# EAGLE schematic EnvironmentOnAStickV2 (EAGLE 7.4.0)
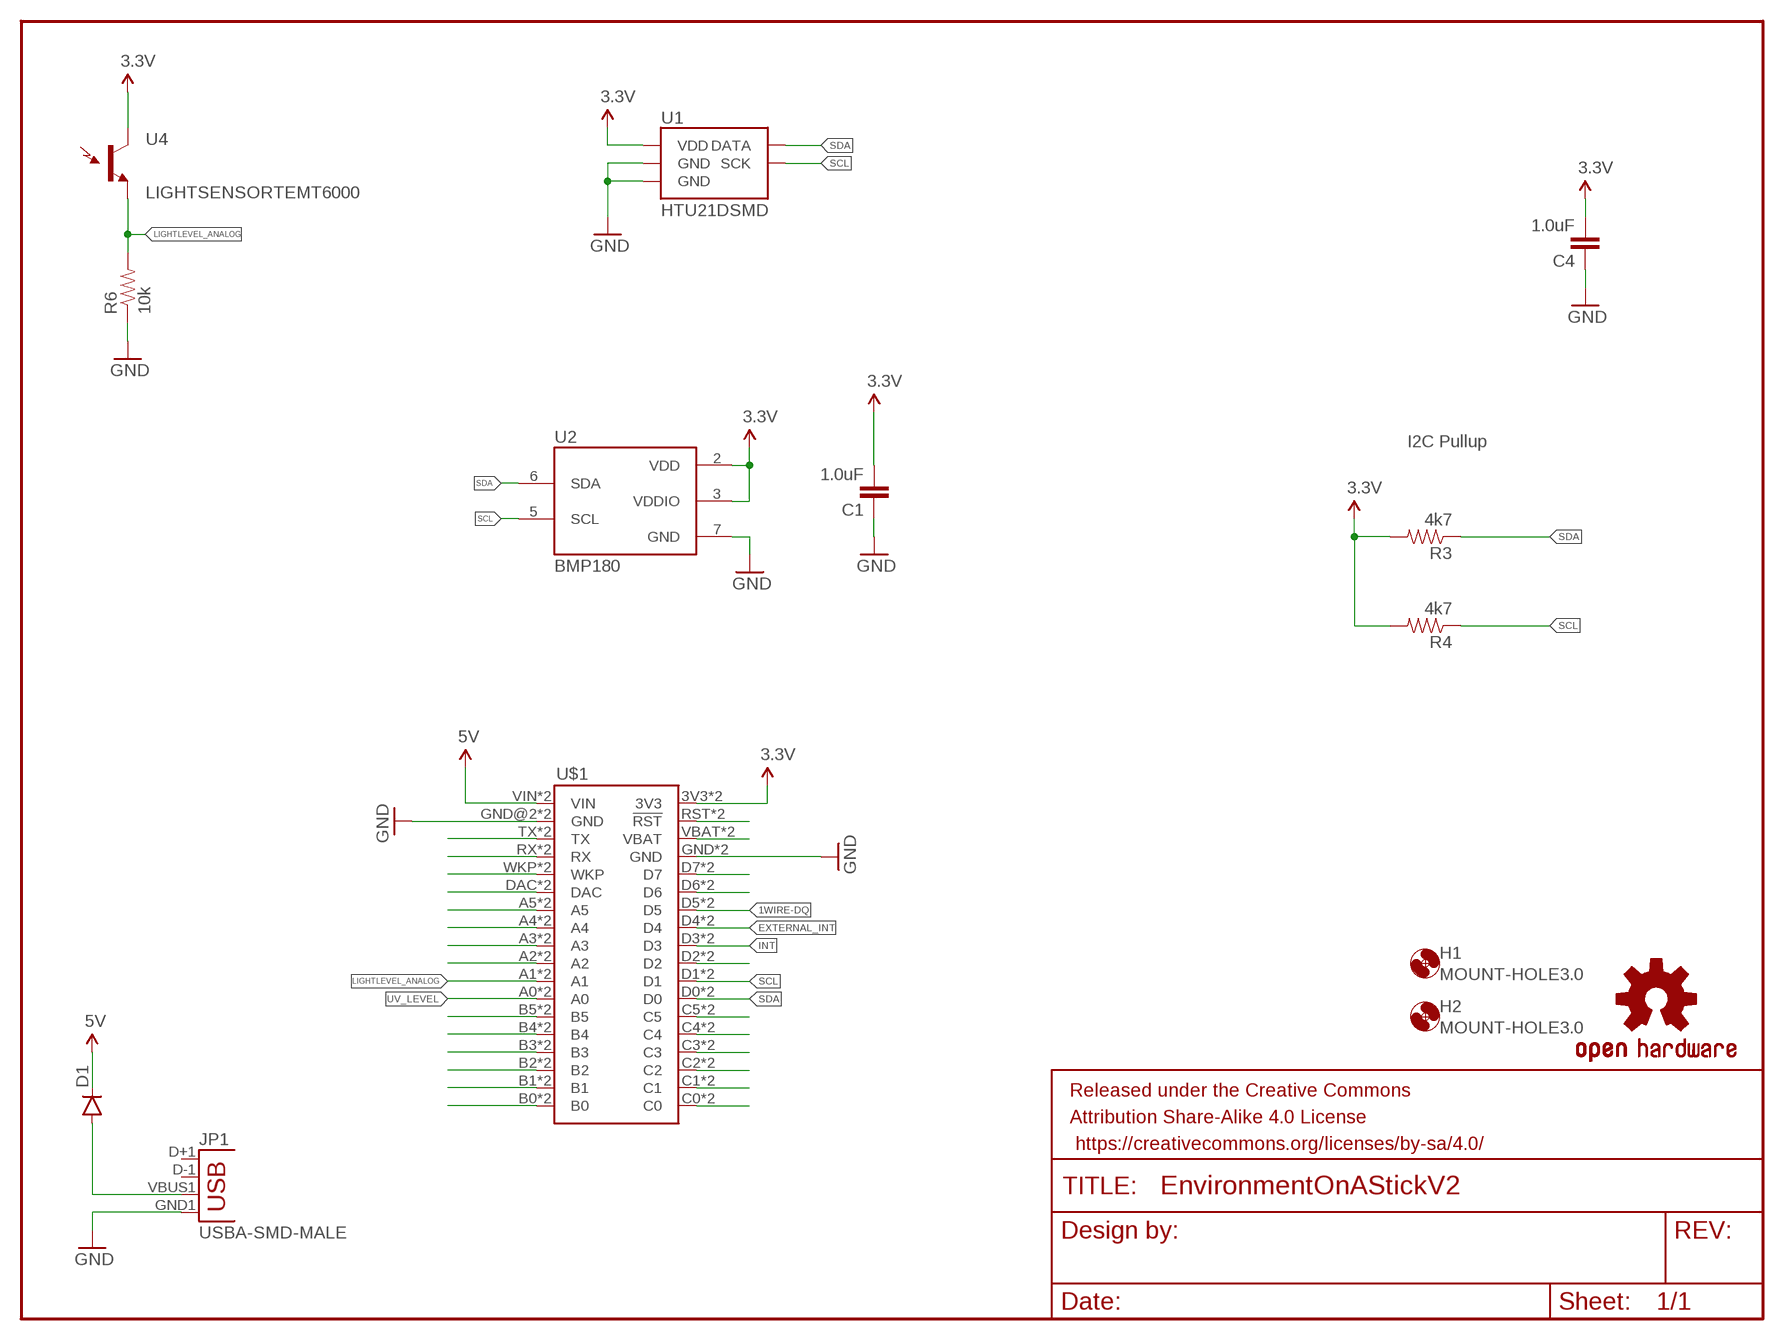
[diagram p0: schematic, sheet 1]

## Parts
C1  1.0uF  1.0UF-25V-+80/-20(0805)"  [0805-CAP]
C4  1.0uF  1.0UF-25V-+80/-20(0805)"  [0805-CAP]
D1  DIODESMA  [SMA-DIODE]
FRAME1  FRAME-LETTER  [CREATIVE_COMMONS]
H1  MOUNT-HOLE3.0  [3,0]
H2  MOUNT-HOLE3.0  [3,0]
JP1  USBA-SMD-MALE  [USB-A-SMT-MALE]
LOGO1  OSHW-LOGOM  [OSHW-LOGO-M]
R3  4k7  RESISTOR0805-RES  [0805]
R4  4k7  RESISTOR0805-RES  [0805]
R6  10k  RESISTOR0805-RES  [0805]
U1  HTU21DSMD  [HTU21D]
U2  BMP180  [BMP180]
U4  LIGHTSENSORTEMT6000  [TEMT6000-SEN]
U$1  ELECTRONDUALNAMED  [ELECTRON_SIMPLE_SILK_NAMES_DUAL]

## Nets
1WIRE-DQ: U$1.D5 U$1.D5_1(D5)
3.3V: C1.2 C4.2 R3.2 R4.2 U1.VDD U2.2(VDD) U2.3(VDDIO) U4.COLLECTOR(C1) U$1.3V3 U$1.3V3_1(3V3)
5V: D1.C U$1.VIN U$1.VIN_1B(VIN)
EXTERNAL_INT: U$1.D4 U$1.D4_1(D4)
GND: C1.1 C4.1 JP1.GND1(GND) R6.1 U1.7(GND) U1.GND U2.7(GND) U$1.GND U$1.GND@2(GND) U$1.GND_1(GND) U$1.GND_1B(GND)
INT: U$1.D3 U$1.D3_1(D3)
LIGHTLEVEL_ANALOG: R6.2 U4.EMITTER(E1) U$1.A1 U$1.A1_1(A1)
N$1: U$1.RST(!RST) U$1.RST_1(!RST)
N$2: U$1.VBAT U$1.VBATT_1(VBAT)
N$3: U$1.D7 U$1.D7_1(D7)
N$4: U$1.D6 U$1.D6_1(D6)
N$5: D1.A JP1.VBUS1(VBUS)
N$8: U$1.D2 U$1.D2_1(D2)
N$11: U$1.C5 U$1.C5_1(C5)
N$12: U$1.C4 U$1.C4_1(C4)
N$13: U$1.C3 U$1.C3_1(C3)
N$14: U$1.C2 U$1.C2_1(C2)
N$15: U$1.C1 U$1.C1_1(C1)
N$16: U$1.C0 U$1.C0_1(C0)
N$17: U$1.B0 U$1.B0_1(B0)
N$18: U$1.B1 U$1.B1_1(B1)
N$19: U$1.B2 U$1.B2_1(B2)
N$20: U$1.B3 U$1.B3_1(B3)
N$21: U$1.B4 U$1.B4_1(B4)
N$22: U$1.B5 U$1.B5_1(B5)
N$25: U$1.A2 U$1.A2_1(A2)
N$26: U$1.A3 U$1.A3_1(A3)
N$27: U$1.A4 U$1.A4_1(A4)
N$28: U$1.A5 U$1.A5_1(A5)
N$29: U$1.DAC U$1.DAC_1(DAC)
N$30: U$1.WKP U$1.WKP_1(WKP)
N$31: U$1.RX U$1.RX_1(RX)
N$32: U$1.TX U$1.TX_1(TX)
SCL: R4.1 U1.SCK U2.5(SCL) U$1.D1 U$1.D1_1(D1)
SDA: R3.1 U1.DATA U2.6(SDA) U$1.D0 U$1.D0_1(D0)
UV_LEVEL: U$1.A0 U$1.A0_1(A0)
Unconnected: JP1.D+1(D+) JP1.D-1(D-)

## Notes on the sheet
- I2C Pullup

## Library data of the parts
C1 C4 = SparkFun-Capacitors:1.0UF-25V-+80/-20(0805): CAP-11625; PROD_ID: CAP-11625
D1 = SparkFun-DiscreteSemi:DIODE: Diode These are standard reverse protection diodes and small signal diodes. SMA package can handle up to about 1A. SOD-323 can handle about 200mA. What the SOD-323 package when ordering, there are some mfgs out there that are 5-pin packages.
FRAME1 = SparkFun-Aesthetics:FRAME-LETTER: Schematic Frame Standard 8.5x11 US Letter frame
H1 H2 = holes:MOUNT-HOLE: MOUNTING HOLE with drill center marker
JP1 = Tinamous:USB: USB Connectors USB-B-PTH is fully proven SKU : PRT-00139/CONN-08278 USB-miniB is fully proven SKU : PRT-00587 USB-A-PCB is untested. USB-A-H is throughly reviewed, but untested. Spark Fun Electronics SKU : PRT-00437 USB-B-SMT is throughly reviewed, but untested. Needs silkscreen touching up. USB-A-S has not been used/tested USB-MB-H has not been used/tested USB-MICROB has been used. CONN-09505
LOGO1 = SparkFun-Aesthetics:OSHW-LOGO: Open Source Hardware Logo This logo indicates the piece of hardware it is found on incorporates a OSHW license and/or adheres to the definition of open source hardware found here: http://freedomdefined.org/OSHW
R3 R4 R6 = SparkFun-Resistors:RESISTOR: Resistor Basic schematic elements and footprints for 0603, 1206, and PTH resistors.
U1 = SparkFun-Sensors:HTU21D; PROD_ID: IC-11793
U2 = SparkFun-Sensors:BMP180: BOSCH BMP180 DIGITAL BAROMETRIC PRESSURE SENSOR Web page: http://www.bosch-sensortec.com/en/homepage/products_3/environmental_sensors_1/bmp180_1/bmp180 Datasheet: http://ae-bst.resource.bosch.com/media/products/dokumente/bmp180/BST-BMP180-DS000-09.pdf The BMP180 is the function compatible successor of the BMP085, a new generation of high precision digital pressure sensors for consumer applications. The ultra-low power, low voltage electronics of the BMP180 is optimized for use in mobile phones, PDAs, GPS navigation devices and outdoor equipment. With a low altitude noise of merely 0.25m at fast conversion time, the BMP180 offers superior performance. The I2C interface allows for easy system integration with a microcontroller. The BMP180 is based on piezo-resistive technology for EMC robustness, high accuracy and linearity as well as long term stability. Key features: - Temperature measurement included - I2C interface - Fully calibrated - Pb-free, halogen-free and RoHS compliant, - MSL 1 Basic specs: Pressure range: 300 to 1100hPa (+9000m to -500m relating to sea level) Supply voltage: 1.8 to 3.6V (VDD), 1.62V to 3.6V (VDDIO) Package: LGA package with metal lid Small footprint: 3.6mm x 3.8mm Super-flat: 0.93mm height Low power: 5μA at 1 sample / sec. in standard mode Low noise: 0.06hPa (0.5m) in ultra low power mode, 0.02hPa (0.17m) advanced resolution mode Typical applications: - Enhancement of GPS navigation (dead-reckoning, slope detection, etc.) - In- and out-door navigation - Leisure and sports - Weather forecast - Vertical velocity indication (rise/sink speed)
U4 = SparkFun-Sensors:LIGHTSENSOR: Ambient Light Sensor Simple light detection sensor. Output varies with light intensity input. Spark Fun Electronics SKU : COM-08348
U$1 = Tinamous:ELECTRON